# Altium schematic sheet Sheet1.SchDoc
size A
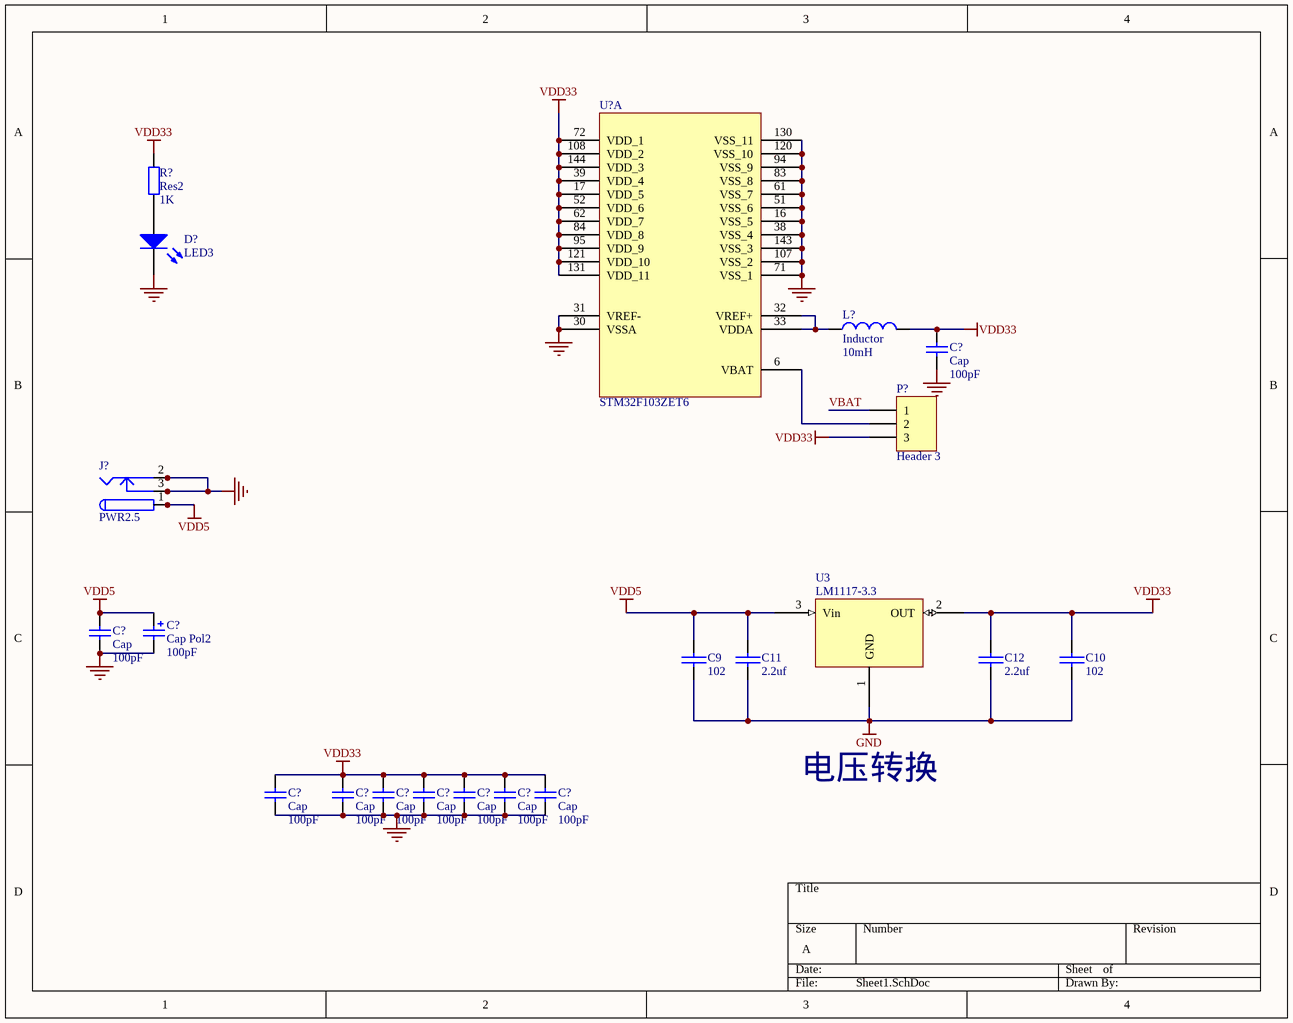
[diagram p0: Sheet1.SchDoc]

## Parts
(Parts that share a designator on the sheet are numbered #1, #2 ... from top to bottom, then left to right.)
C9  102  [0805]
C10  102  [0805]
C11  2.2uf  [1210]
C12  2.2uf  [1210]
C?#1  Cap  value 100pF  [RAD-0.3]
C?#2  Cap Pol2  value 100pF  [POLAR0.8]
C?#3  Cap  value 100pF  [RAD-0.3]
C?#4  Cap  value 100pF  [RAD-0.3]
C?#5  Cap  value 100pF  [RAD-0.3]
C?#6  Cap  value 100pF  [RAD-0.3]
C?#7  Cap  value 100pF  [RAD-0.3]
C?#8  Cap  value 100pF  [RAD-0.3]
C?#9  Cap  value 100pF  [RAD-0.3]
C?#10  Cap  value 100pF  [RAD-0.3]
D?  LED3  [3.5X2.8X1.9]
J?  PWR2.5  [KLD-0202]
L?  Inductor  value 10mH  [0402-A]
P?  Header 3  [HDR1X3]
R?  Res2  value 1K  [AXIAL-0.4]
U3  LM1117-3.3  [SOT-223]
U?  STM32F103ZET6  (part A of 3)

## Nets
GND: C9.2 C10.2 C11.2 C12.2 C?#1.1 C?#2.2 C?#3.1 C?#4.1 C?#5.1 C?#6.1 C?#7.1 C?#8.1 C?#9.1 C?#10.1 D?.2(K) J?.2 J?.2A J?.2B J?.3 J?.3A J?.3B U3.1(GND) U?.16(VSS_5) U?.30(VSSA) U?.31(VREF-) U?.38(VSS_4) U?.51(VSS_6) U?.61(VSS_7) U?.71(VSS_1) U?.83(VSS_8) U?.94(VSS_9) U?.107(VSS_2) U?.120(VSS_10) U?.130(VSS_11) U?.143(VSS_3)
VDD5: C9.1 C11.1 C?#2.1 C?#3.2 J?.1 J?.1A J?.1B U3.3(Vin)
VDD33: C10.1 C12.1 C?#1.2 C?#4.2 C?#5.2 C?#6.2 C?#7.2 C?#8.2 C?#9.2 C?#10.2 L?.2 P?.3 R?.2 U3.2(OUT) U?.17(VDD_5) U?.39(VDD_4) U?.52(VDD_6) U?.62(VDD_7) U?.72(VDD_1) U?.84(VDD_8) U?.95(VDD_9) U?.108(VDD_2) U?.121(VDD_10) U?.131(VDD_11) U?.144(VDD_3)
VBAT: P?.1
NetD?_1: D?.1(A) R?.1
NetL?_1: L?.1 U?.32(VREF+) U?.33(VDDA)
NetP?_2: P?.2 U?.6(VBAT)

## Notes on the sheet
- 电压转换

## Library data of the parts
C9-C12 = CAP: Capacitor
C?#1 C?#3-C?#10 = Cap: Capacitor; Published: 8-Jun-2000; LatestRevisionDate: 17-Jul-2002; LatestRevisionNote: Re-released for DXP Platform.; PackageReference: RAD-0.3; Publisher: Altium Limited
C?#2 = Cap Pol2: Polarized Capacitor (Axial); Published: 8-Jun-2000; LatestRevisionDate: 17-Jul-2002; LatestRevisionNote: Re-released for DXP Platform.; PackageReference: POLAR0.8; Publisher: Altium Limited
D? = LED3: Typical BLUE SiC LED; Published: 8-Jun-2000; LatestRevisionDate: 17-Dec-2003; LatestRevisionNote: PCB Footprint replaced.; DatasheetDocument: 16-Apr-2002; PackageDocument: 16-Apr-2002; PackageReference: 3.5X2.8X1.9; Publisher: Altium Limited
J? = PWR2.5: Low Voltage Power Supply Connector; Published: 17-Dec-2003; DatasheetDocument: 09-May-2002; Publisher: Altium Limited; ComponentLink1Description: Manufacturer Link; ComponentLink1URL: http://domino.kycon.com/internet/Products.html
L? = Inductor: Code_IEC: 1005; Published: 8-Jun-2000; LatestRevisionDate: 17-Jul-2002; LatestRevisionNote: Re-released for DXP Platform.; PackageReference: 0402-A; Publisher: Altium Limited; Code_JEITA: 0402
P? = Header 3: Header, 3-Pin; LatestRevisionDate: 17-Jul-2002; LatestRevisionNote: Re-released for DXP Platform.; Publisher: Altium Limited
R? = Res2: Resistor; Published: 8-Jun-2000; LatestRevisionDate: 17-Jul-2002; LatestRevisionNote: Re-released for DXP Platform.; PackageReference: AXIAL-0.4; Publisher: Altium Limited